# Altium schematic sheet Voltage_Control.SchDoc
size A4; SheetNumber: 8; SheetTotal: 8
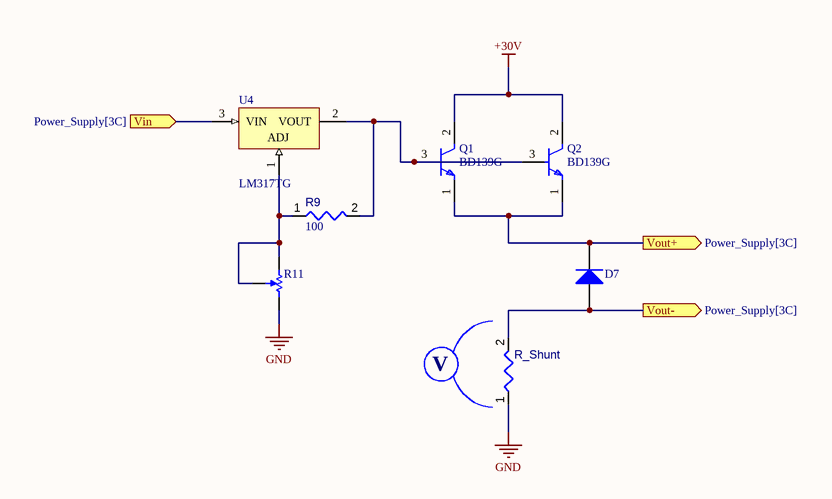
[diagram p0: Voltage_Control.SchDoc]

## Parts
D7  1N4007  [FAIR-DO-41-2]  (value not drawn)
Q1  BD139G  [FP-77-09-MFG]
Q2  BD139G  [FP-77-09-MFG]
R9  value 100  [RESA60-630X240]  (hidden comment: MFR-25FBF52-100R)
R11  3296W-1-102LF  [BOUR-3296W-1-3]  (value not drawn)
R_Shunt  MFR-25FBF52-100R  [RESA60-630X240]  (value not drawn)
U4  LM317TG  [ONSC-TO-220-3-221AB-01]

## Ports
Vin (in, see Power_Supply[3C]), Vout+ (out, see Power_Supply[3C]), Vout- (out, see Power_Supply[3C])

## Nets
+30V: Q1.2(C) Q2.2(C)
GND: R11.2(B) R_Shunt.1
Vin: U4.3(VIN) ; port Vin
Vout+: D7.1(K) Q1.1(E) Q2.1(E) ; port Vout+
Vout-: D7.2(A) R_Shunt.2 ; port Vout-
NetQ1_3: Q1.3(B) Q2.3(B) R9.2 U4.2(VOUT)
NetR9_1: R9.1 R11.1(A) R11.3(TAP) U4.1(ADJ)

## Notes on the sheet
- V

## Library data of the parts
D7 = CMP-004-00007-2: General Purpose Rectifier, 1.1 V, 1.0 A, -55 to 175 degC, 2-Pin DO-41, RoHS, Tape and Reel; Manufacturer: Fairchild; Peak Reverse Current: 5uA; Max Surge Current: 30A; Elements: 1; Forward Voltage: 1.1V; Package Version: Rev. 2, 09/2008; Forward Current: 1A; Package Quantity: 5000; Packaging: TapeandReel; Package URL: http://www.fairchildsemi.com/dwg/DO/DO41A.pdf; Manufacturer URL: https://www.fairchildsemi.com/; Package Reference: DO-41-2; Pins: 2; Min Operating Temperature: -55°C; Datasheet Version: Rev. 1.1.0, 11/2014; Max Operating Temperature: 175°C; RoHS Compliant: True; Case/Package: DO-41-2; Mounting Technology: TH; Package Description: 2-Pin Axial Lead, Dia 2.375 mm, Body Length 4.63 mm; Datasheet URL: https://www.fairchildsemi.com/datasheets/1N/1N4007.pdf
Q1 Q2 = CMP-013-00035-1: 1.5 A, 80 V NPN Power Bipolar Junction Transistor. ONSSPCTRNSTLT1T0R;; Pins: 3; Max Operating Temperature: 150°C; Case/Package: TO-225; Min Operating Temperature: -55°C; Mounting Technology: Through Hole
R9 = CMP-009-00046-5: Axial Resistor, 100 Ohm, +/- 1%, 0.25 W, -55 to 155 degC, 2-Pin THD, RoHS, Bulk; Manufacturer: Yageo; Power: 250mW; Voltage Rating: 250V; Tolerance: 1%; Packaging: Bulk; Max Operating Temperature: 155°C; Package Reference: MFR-25; Case/Package: Axial; Package Description: 2-Pin Axial Lead, Dia 2.4 mm, Body Length 6.3 mm; RoHS Compliant: True; Composition: CarbonFilm; Datasheet URL: http://www.yageo.com/documents/recent/Yageo%20LR_MFR_2013.pdf; Min Operating Temperature: -55°C; Package Quantity: 200; Mounting Technology: TH; Datasheet Version: Apr-13; Manufacturer URL: http://www.yageo.com/
R11 = CMP-009-00037-2: Square Trimpot(R) Trimming Potentiometer, 1000 Ohm, -55 to 125 degC, 3-Pin THD, RoHS, Tube; Manufacturer: Bourns; Power: 500mW; Tolerance: 10%; Voltage Rating: 300V; Resistance: 1k; Datasheet Version: May-16; Min Operating Temperature: -55°C; Max Operating Temperature: 150°C; Composition: Potentiometer; Package Description: 3-Pin Through Hole Device, Body 9.53 x 4.83 mm, Pitch 2.54 mm; Manufacturer URL: http://www.bourns.com/; Package Reference: 3296W-1-3; RoHS Compliant: True; Case/Package: 3296W-1-3; Packaging: Rail/Tube; Mounting Technology: TH; Package Quantity: 50; Datasheet URL: http://www.bourns.com/docs/Product-Datasheets/3296.pdf
R_Shunt = CMP-009-00046-5: Axial Resistor, 100 Ohm, +/- 1%, 0.25 W, -55 to 155 degC, 2-Pin THD, RoHS, Bulk; Manufacturer: Yageo; Power: 250mW; Voltage Rating: 250V; Value: 0.1; Tolerance: 1%; Packaging: Bulk; Max Operating Temperature: 155°C; Package Reference: MFR-25; Case/Package: Axial; Package Description: 2-Pin Axial Lead, Dia 2.4 mm, Body Length 6.3 mm; RoHS Compliant: True; Composition: CarbonFilm; Datasheet URL: http://www.yageo.com/documents/recent/Yageo%20LR_MFR_2013.pdf; Min Operating Temperature: -55°C; Package Quantity: 200; Mounting Technology: TH; Datasheet Version: Apr-13; Manufacturer URL: http://www.yageo.com/
U4 = CMP-019-00023-3: Adjustable Output, Positive Voltage Regulator, 1.5 A, 0 to 125 degC, 3-Pin TO-220 (221AB-01), Pb-Free, Rail; Manufacturer: ON Semiconductor; Outputs: 1; Max Input Voltage: 40V; Min Input Voltage: 4.2V; Output Current: 1.5A; Output Voltage: 1.2V; Package Version: Rev. A, 11/2010; Mounting Technology: TH; Case/Package: TO-220; Package Description: 3-Pin Flange Mount, Vertical Straight Lead, Body 9.97 x 4.445 mm, Pitch 2.54 mm; Package Reference: TO-220-3-221AB-01; Manufacturer URL: http://www.onsemi.com/; Package Quantity: 50; Datasheet Version: Rev. 14, 01/2016; Max Ouput Current: 1.5A; Min Operating Temperature: 0°C; Packaging: Rail/Tube; Datasheet URL: http://www.onsemi.com/pub_link/Collateral/LM317-D.PDF; Max Operating Temperature: 125°C; RoHS Compliant: True; Pins: 3